# Altium schematic sheet Signal Generator_SCH.SchDoc
size B; CompanyName: ES2H; ProjectName: Signal Generator Lawn Mover
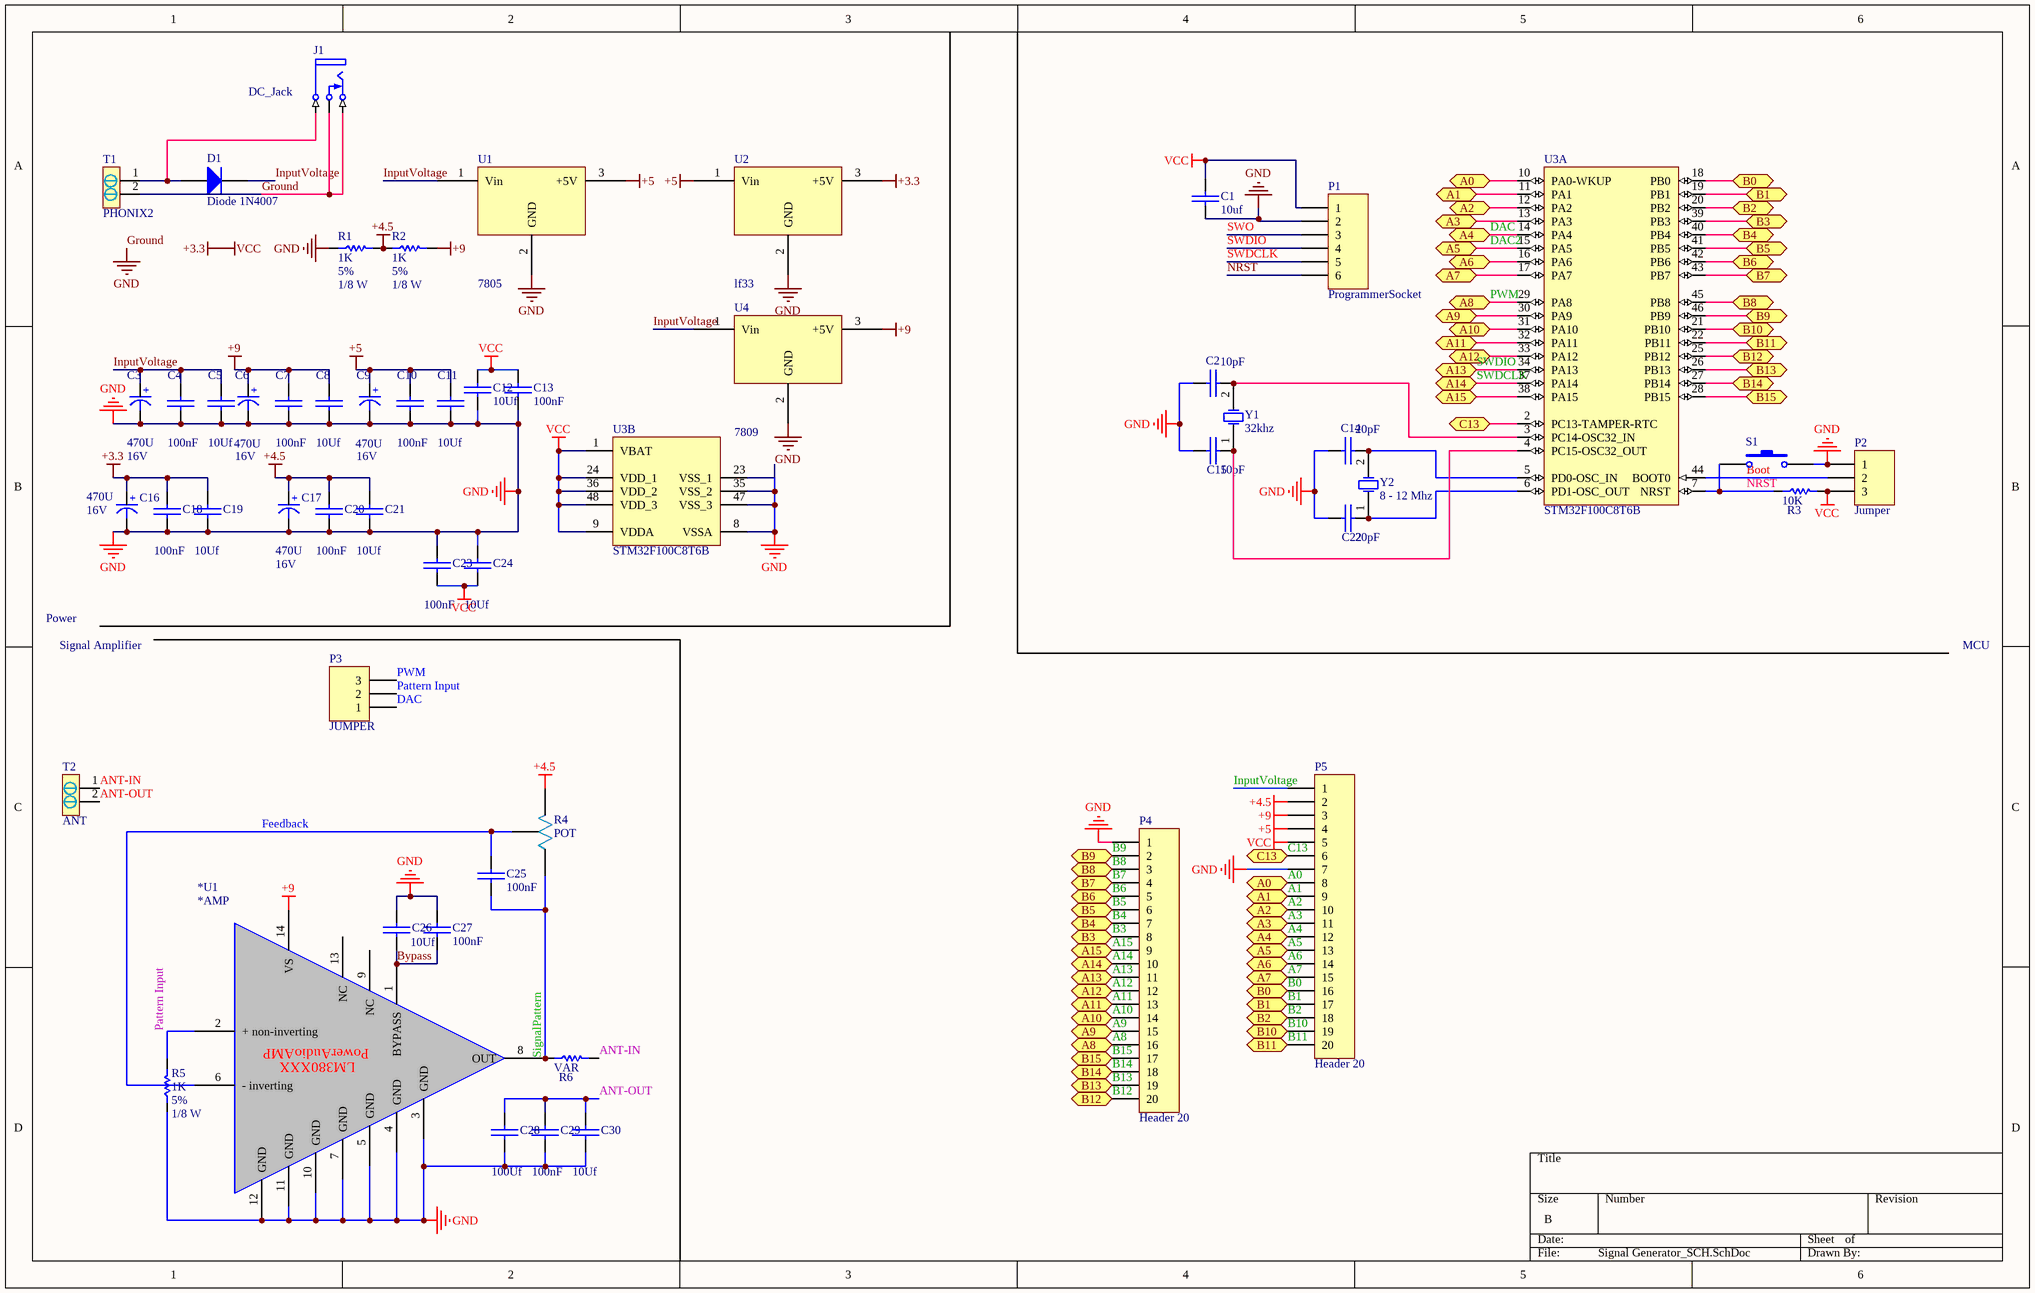
[diagram p0: Signal Generator_SCH.SchDoc]

## Parts
*U1  *AMP  [LM380N-DIP]
C1  10uf  [SMD_CAP_1206]
C2  10pF  [SMD_CAP_1206]
C3  Voltage: 16V  [cap 01]  (hidden comment: 470U)
C4  100nF  [SMD_CAP_1206]
C5  10Uf  [SMD_CAP_1206]
C6  Voltage: 16V  [cap 01]  (hidden comment: 470U)
C7  100nF  [SMD_CAP_1206]
C8  10Uf  [SMD_CAP_1206]
C9  Voltage: 16V  [cap 01]  (hidden comment: 470U)
C10  100nF  [SMD_CAP_1206]
C11  10Uf  [SMD_CAP_1206]
C12  10Uf  [SMD_CAP_1206]
C13  100nF  [SMD_CAP_1206]
C14  20pF  [SMD_CAP_1206]
C15  10pF  [SMD_CAP_1206]
C16  Voltage: 16V  [cap 01]  (hidden comment: 470U)
C17  Voltage: 16V  [cap 01]  (hidden comment: 470U)
C18  100nF  [SMD_CAP_1206]
C19  10Uf  [SMD_CAP_1206]
C20  100nF  [SMD_CAP_1206]
C21  10Uf  [SMD_CAP_1206]
C22  20pF  [SMD_CAP_1206]
C23  100nF  [SMD_CAP_1206]
C24  10Uf  [SMD_CAP_1206]
C25  100nF  [SMD_CAP_1206]
C26  10Uf  [SMD_CAP_1206]
C27  100nF  [SMD_CAP_1206]
C28  100Uf  [SMD_CAP_1206]
C29  100nF  [SMD_CAP_1206]
C30  10Uf  [SMD_CAP_1206]
D1  Diode 1N4007  [DO-41]
J1  DC_Jack  [My_DC_Jack]
P1  ProgrammerSocket  [HDR1X6]
P2  Jumper  [HDR1X3]
P3  JUMPER  [HDR1X3]
P4  Header 20  [HDR1X20]
P5  Header 20  [HDR1X20]
R1  Tolerance: 5%  Power: 1/8 W  [RES 1206 (3216X08L)]  (hidden comment: 1K)
R2  Tolerance: 5%  Power: 1/8 W  [RES 1206 (3216X08L)]  (hidden comment: 1K)
R3  10K  [RES 1206 (3216X08L)]
R4  POT  [MOL_1]
R5  Tolerance: 5%  Power: 1/8 W  [RES 1206 (3216X08L)]  (hidden comment: 1K)
R6  VAR  [RES 1206 (3216X08L)]
S1  Switch PB  [Switch - Push to On]  (value not drawn)
T1  PHONIX2  [PHONIX2]
T2  ANT  [PHONIX2]
U1  7805  [My_TO-220]
U2  lf33  [My_TO-220]
U3  STM32F100C8T6B  [STM-LQFP48_N]  (parts A,B of 2)
U4  7809  [My_TO-220]
Y1  32khz  [XTAL RTC]
Y2  8 - 12 Mhz  [XTAL Small]

## Ports
A0 (bidir), A1 (bidir), A2 (bidir), A3 (bidir), A4 (bidir), A5 (bidir), A6 (bidir), A7 (bidir), A8 (bidir), A9 (bidir), A10 (bidir), A11 (bidir), A12 (bidir), A13 (bidir), A14 (bidir), A15 (bidir), B0 (bidir), B1 (bidir), B2 (bidir), B3 (bidir), B4 (bidir), B5 (bidir), B6 (bidir), B7 (bidir), B8 (bidir), B9 (bidir), B10 (bidir), B11 (bidir), B12 (bidir), B13 (bidir), B14 (bidir), B15 (bidir), C13 (bidir)

## Nets
+3.3: C1.2(-) C12.2(-) C13.2(-) C16.1(+) C18.1(+) C19.1(+) C23.2(-) C24.2(-) P1.1 P2.3 P5.5 R3.2 U2.3(+5V) U3.1(VBAT) U3.9(VDDA) U3.24(VDD_1) U3.36(VDD_2) U3.48(VDD_3)  [also labelled VCC]
+4.5: C17.1(+) C20.1(+) C21.1(+) P5.2 R1.2 R2.1 R4.3
+5: C9.1(+) C10.1(+) C11.1(+) P5.4 U1.3(+5V) U2.1(Vin)
+9: *U1.14(VS) C6.1(+) C7.1(+) C8.1(+) P5.3 R2.2 U4.3(+5V)
Ground: *U1.3(GND) *U1.4(GND) *U1.5(GND) *U1.7(GND) *U1.10(GND) *U1.11(GND) *U1.12(GND) C1.1(+) C2.2(-) C3.2(-) C4.2(-) C5.2(-) C6.2(-) C7.2(-) C8.2(-) C9.2(-) C10.2(-) C11.2(-) C12.1(+) C13.1(+) C14.2(-) C15.2(-) C16.2(-) C17.2(-) C18.2(-) C19.2(-) C20.2(-) C21.2(-) C22.2(-) C23.1(+) C24.1(+) C26.2(-) C27.2(-) C28.2(-) C29.2(-) C30.2(-) J1.1(T) J1.2(TN) P1.2 P2.1 P4.1 P5.7 R1.1 R5.1 S1.2 T1.2 U1.2(GND) U2.2(GND) U3.8(VSSA) U3.23(VSS_1) U3.35(VSS_2) U3.47(VSS_3) U4.2(GND)  [also labelled GND]
A0: P5.8 U3.10(PA0-WKUP) ; port A0
A1: P5.9 U3.11(PA1) ; port A1
A2: P5.10 U3.12(PA2) ; port A2
A3: P5.11 U3.13(PA3) ; port A3
A4: P3.1 P5.12 U3.14(PA4) ; port A4  [also labelled DAC]
A5: P5.13 U3.15(PA5) ; port A5  [also labelled DAC2]
A6: P5.14 U3.16(PA6) ; port A6
A7: P5.15 U3.17(PA7) ; port A7
A8: P3.3 P4.16 U3.29(PA8) ; port A8  [also labelled PWM]
A9: P4.15 U3.30(PA9) ; port A9
A10: P4.14 U3.31(PA10) ; port A10
A11: P4.13 U3.32(PA11) ; port A11
A12: P4.12 U3.33(PA12) ; port A12
A13: P1.4 P4.11 U3.34(PA13) ; port A13  [also labelled SWDIO]
A14: P1.5 P4.10 U3.37(PA14) ; port A14  [also labelled SWDCLK]
A15: P4.9 U3.38(PA15) ; port A15
ANT-IN: R6.2 T2.1
ANT-OUT: C28.1(+) C29.1(+) C30.1(+) T2.2
B0: P5.16 U3.18(PB0) ; port B0
B1: P5.17 U3.19(PB1) ; port B1
B2: P5.18 U3.20(PB2) ; port B2
B3: P4.8 U3.39(PB3) ; port B3
B4: P4.7 U3.40(PB4) ; port B4
B5: P4.6 U3.41(PB5) ; port B5
B6: P4.5 U3.42(PB6) ; port B6
B7: P4.4 U3.43(PB7) ; port B7
B8: P4.3 U3.45(PB8) ; port B8
B9: P4.2 U3.46(PB9) ; port B9
B10: P5.19 U3.21(PB10) ; port B10
B11: P5.20 U3.22(PB11) ; port B11
B12: P4.20 U3.25(PB12) ; port B12
B13: P4.19 U3.26(PB13) ; port B13
B14: P4.18 U3.27(PB14) ; port B14
B15: P4.17 U3.28(PB15) ; port B15
Boot: P2.2 U3.44(BOOT0)
Bypass: *U1.1(BYPASS) C26.1(+) C27.1(+)
C13: P5.6 U3.2(PC13-TAMPER-RTC) ; port C13
Feedback: *U1.6(-_inverting) C25.1(+) R4.2
InputVoltage: C3.1(+) C4.1(+) C5.1(+) D1.2(K) P5.1 U1.1(Vin) U4.1(Vin)
NRST: P1.6 R3.1 S1.1 U3.7(NRST)
Pattern Input: *U1.2(+_non-inverting) P3.2 R5.2
SignalPattern: *U1.8(OUT) C25.2(-) R4.1 R6.1
SWO: P1.3
NetC2_1: C2.1(+) U3.3(PC14-OSC32_IN) Y1.2(OSC2)
NetC14_1: C14.1(+) U3.5(PD0-OSC_IN) Y2.2(OSC2)
NetC15_1: C15.1(+) U3.4(PC15-OSC32_OUT) Y1.1(OSC1)
NetC22_1: C22.1(+) U3.6(PD1-OSC_OUT) Y2.1(OSC1)
NetD1_1: D1.1(A) J1.3(S) T1.1

Not connected (* = marked no-connect by the designer): *U1 9(NC) 13(NC)

## Notes on the sheet
- Power
- Signal Amplifier
- MCU
- (in symbol LM380N) PowerAudioAMP; LM380XXX

## Library data of the parts
*U1 = LM380N: Desinator: Ehsan Shaghaei; Email: Ehsan2754@yahoo.com
C1 C2 C4 C5 C7 C8 C10-C15 C18-C30 = Cap-Bipolar: Bipolar Capacitor; Voltage: 100V; Designer: Saeid Jorablo; Organazation: ControTec; Adding Date: 1387/12/20
  C1: Value: 10uf
  C2 C15: Value: 10pF
  C4 C7 C10 C13 C18 C20 C23 C25 C27 C29: Value: 100nF
  C5 C8 C11 C12 C19 C21 C24 C26 C30: Value: 10Uf
  C14 C22: Value: 20pF
  C28: Value: 100Uf
C3 C6 C9 C16 C17 = Cap-Polar: Polar Capacitor; Designer: Saeid Jorablo; Organazation: ControTec; Adding Date: 1387/12/20; Value: 470U
D1 = Diode 1N4007: 1 Amp General Purpose Rectifier; Published: 8-Jun-2000; LatestRevisionDate: 17-Jul-2002; LatestRevisionNote: Re-released for DXP Platform.; DatasheetVersion: 1998; PackageVersion: Aug-1999; PackageReference: DO-41; Publisher: Altium Limited; PackageDescription: Diode, Axial; Body 5.2 x 2.7 mm (LxDia. max), Lead Dia. 0.86 mm (max); Code_JEDEC: DO-204-AL; ComponentLink1Description: Manufacturer Link; ComponentLink1URL: http://www.fairchildsemi.com/; ComponentLink2Description: Datasheet; ComponentLink2URL: http://www.fairchildsemi.com/ds/1N%2F1N4001.pdf
J1 = DC_Jack: PackageDocument: 2003; PCB_Layout: Complies with manufacturer's recommendation.; DrillAndSlotSize: Corresponds to nominal value.; LatestRevisionDate: 15-Jul-2004; LatestRevisionNote: Component Replaced & renamed from "Phonejack".; DatasheetDocument: 2003; PackageReference: S1VS_SNB; Publisher: Altium Limited; ComponentLink1Description: Manufacturer Link; ComponentLink1URL: http://www.cliffuk.co.uk/
P1 = Header 6: Header, 6-Pin; LatestRevisionDate: 17-Jul-2002; LatestRevisionNote: Re-released for DXP Platform.; Publisher: Altium Limited
P2 P3 = Header 3: Header, 3-Pin; LatestRevisionDate: 17-Jul-2002; LatestRevisionNote: Re-released for DXP Platform.; Publisher: Altium Limited
P4 P5 = Header 20: Header, 20-Pin; LatestRevisionDate: 17-Jul-2002; LatestRevisionNote: Re-released for DXP Platform.; Publisher: Altium Limited
R1 R2 R5 = Resistor: Value: 1K
R3 R6 = Resistor: Tolerance: 5%; Power: 1/8 W
  R3: Value: 10K
  R6: Value: VAR
S1 = Switch PB: Push Button Switch
T2 = PHONIX2
U1 U2 U4 = 7805: Regulator
U3 = STM32F100C8T6B: ARM Cortex-M3 32-bit MCU, 64 KB Flash, 8 KB Internal RAM, 37 I/Os, 48-pin LQFP, -40 to 85 degC, Tray; A/D Converter: 1x12-bit (10 Channel); D/A Converter: 2x12-bit (2 Channel); FLASH Size (Prog) (kB): 64; I/Os (High Current): 37; Internal RAM Size (kB): 8; Operating Frequency(F) (Processor speed) (MHz): 24; Supply Voltage(Vcc) min (V): 2; DatasheetVersion: Rev. 7; PackageVersion: Rev. 6, 06/2013; PackageReference: LQFP48; PackageDescription: 48-Pin Low Profile Quad Flat Package, 7 x 7 mm Body, 0.5 mm Pitch; Supplier 1: Digi-Key; Supplier Part Number 1: 497-10499-ND; Supplier 2: Farnell; Supplier Part Number 2: 1838511; Supplier 3: Newark; Supplier Part Number 3: 76R0988; Supplier 4: Mouser; Supplier Part Number 4: 511-STM32F100C8T6B; Core: ARM Cortex-M3; Packing: Tray; Mounting Technology: Surface Mount; PartNumber: STM32F100C8T6B; ComponentLink1Description: Manufacturer URL; ComponentLink1URL: http://www.st.com/web/en/home.html; ComponentLink2Description: Datasheet; ComponentLink2URL: http://www.st.com/st-web-ui/static/active/en/resource/technical/document/datasheet/CD00251732.pdf; ComponentLink3Description: Package Specification; ComponentLink3URL: http://www.st.com/st-web-ui/static/active/en/resource/technical/document/datasheet/DM00058181.pdf
Y1 Y2 = XTAL: XTAL Crystal; Company: E.P.I.L; Design Date: 11/04/2011
  Y1: Value: 32khz
  Y2: Value: 8 - 12 Mhz